# EAGLE design Opto_v2 (EAGLE 8.6.3)
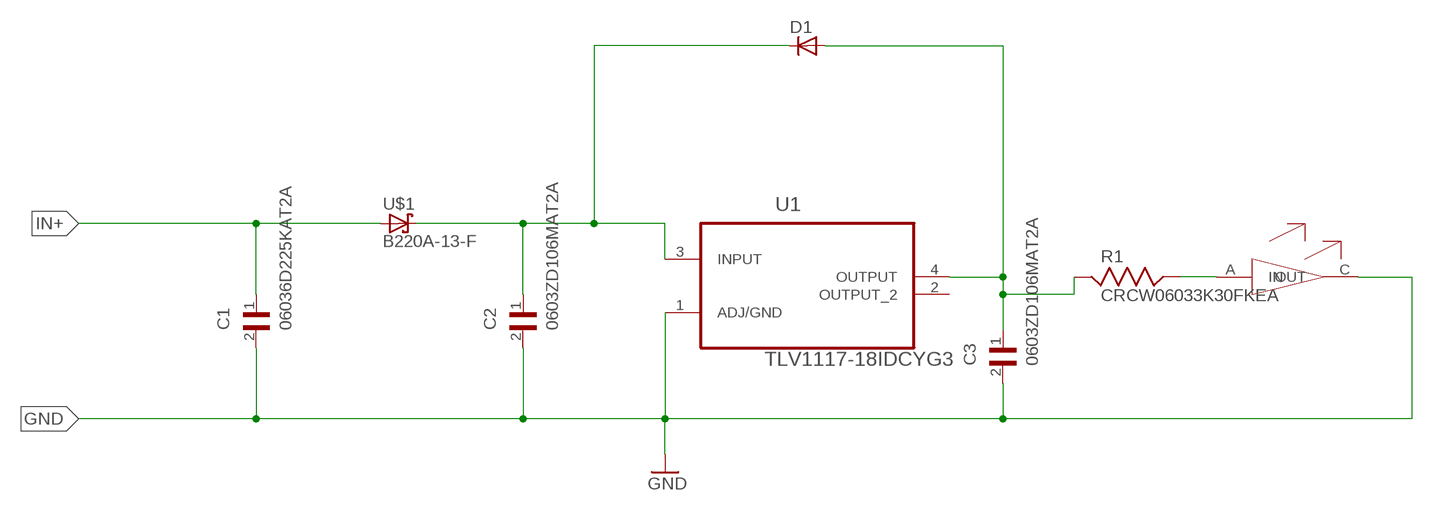
[diagram p0: schematic, sheet 1]

## Parts
C1  06036D225KAT2A  [CAPC1608X90]
C2  0603ZD106MAT2A  [CAPC1608X90]
C3  0603ZD106MAT2A  [CAPC1608X90]
D1  BYS10  [SOD106A]
R1  CRCW06033K30FKEA  [RESC1608X55]
U1  TLV1117-18IDCYG3  [SOT230P700X180-4N]
U$1  B220A-13-F  [SMA-DIODE]
U$3  LED  [LEDM1608X80]

## Nets
GND: C1.2 C2.2 C3.2 U1.1(ADJ/GND) U$3.C(OUT)
IN+: C1.1 U$1.1(A)
N$2: R1.2 U$3.A(IN)
N$3: C3.1 D1.A R1.1 U1.4(OUTPUT)
N$4: C2.1 D1.K U1.3(INPUT) U$1.2(C)
Unconnected: U1.2(OUTPUT_2)

## Library data of the parts
C1 = Capacitor_2.2uF_0603:06036D225KAT2A: Cap Ceramic 2.2uF 6.3V X5R 10% SMD 0603 85°C Paper T/R; DESCRIPTION: 0603 2.2 uF 6.3 V ±10 % Tolerance X5R Surface Mount Multilayer Ceramic Capacitor; DIGI-KEY_PART_NUMBER: 478-1252-1-ND; DIGI-KEY_PURCHASE_URL: https://www.digikey.co.uk/product-detail/en/avx-corporation/06036D225KAT2A/478-1252-1-ND/564284?utm_source=snapeda&utm_medium=aggregator&utm_campaign=symbol; MF: AVX; MP: 06036D225KAT2A; PACKAGE: 0603 AVX
C2 C3 = 0603ZD106MAT2A:0603ZD106MAT2A: Cap Ceramic 10uF 10V X5R 20% SMD 0603 85??? T/R; DESCRIPTION: 0603 10 uF 10 V ±20 % Tolerance X5R SMT Multilayer Ceramic Capacitor; DIGI-KEY_PART_NUMBER: 478-8050-1-ND; DIGI-KEY_PURCHASE_URL: https://www.digikey.com/product-detail/en/avx-corporation/0603ZD106MAT2A/478-8050-1-ND/3900666?utm_source=snapeda&utm_medium=aggregator&utm_campaign=symbol; MF: AVX; MP: 0603ZD106MAT2A; PACKAGE: 0603 AVX
D1 = telefunken:BYS10: DIODE; MPN: BYS10/45; OC_FARNELL: 9549188; OC_NEWARK: 96K7236
R1 = CRCW06033K30FKEA:CRCW06033K30FKEA: Res Thick Film 0603 3.3K Ohm 1% 0.1W(1/10W) ?100ppm/C SMD Automotive Paper T/R; DESCRIPTION: Res Thick Film 0603 3.3K Ohm 1% 0.1W_1/10W_ ?100ppm/C SMD Automotive Paper T/R; DIGI-KEY_PART_NUMBER: 541-3.30KHCT-ND; DIGI-KEY_PURCHASE_URL: https://www.digikey.com/product-detail/en/vishay-dale/CRCW06033K30FKEA/541-3.30KHCT-ND/1179866?utm_source=snapeda&utm_medium=aggregator&utm_campaign=symbol; MF: Vishay Dale; MP: CRCW06033K30FKEA; PACKAGE: 0603 Vishay
U1 = TLV1117-18IDCYG3:TLV1117-18IDCYG3: V REG, LDO, 3.3V, 0.8A; AVAILABILITY: Unavailable; DESCRIPTION: Single Output LDO, 800mA, Fixed and Adj., Internal Current limit, Thermal Overload Protection 4-SOT-223 -40 to 125; MF: Texas Instruments; MP: TLV1117-18IDCYG3; PACKAGE: SOT-223 Texas Instruments; PRICE: None
U$1 = Schottky_0603:B220A-13-F; DESCRIPTION: B220A Series 20 V 2 A Surface Mount Schottky Barrier Rectifier - SMA; DIGI-KEY_PART_NUMBER: B220A-FDICT-ND; DIGI-KEY_PURCHASE_URL: https://www.digikey.co.uk/product-detail/en/diodes-incorporated/B220A-13-F/B220A-FDICT-ND/751528?utm_source=snapeda&utm_medium=aggregator&utm_campaign=symbol; MF: Diodes Inc.; MP: B220A-13-F; PACKAGE: DO-214 Diodes Inc.
U$3 = LEDM1608X80:LED

## Board
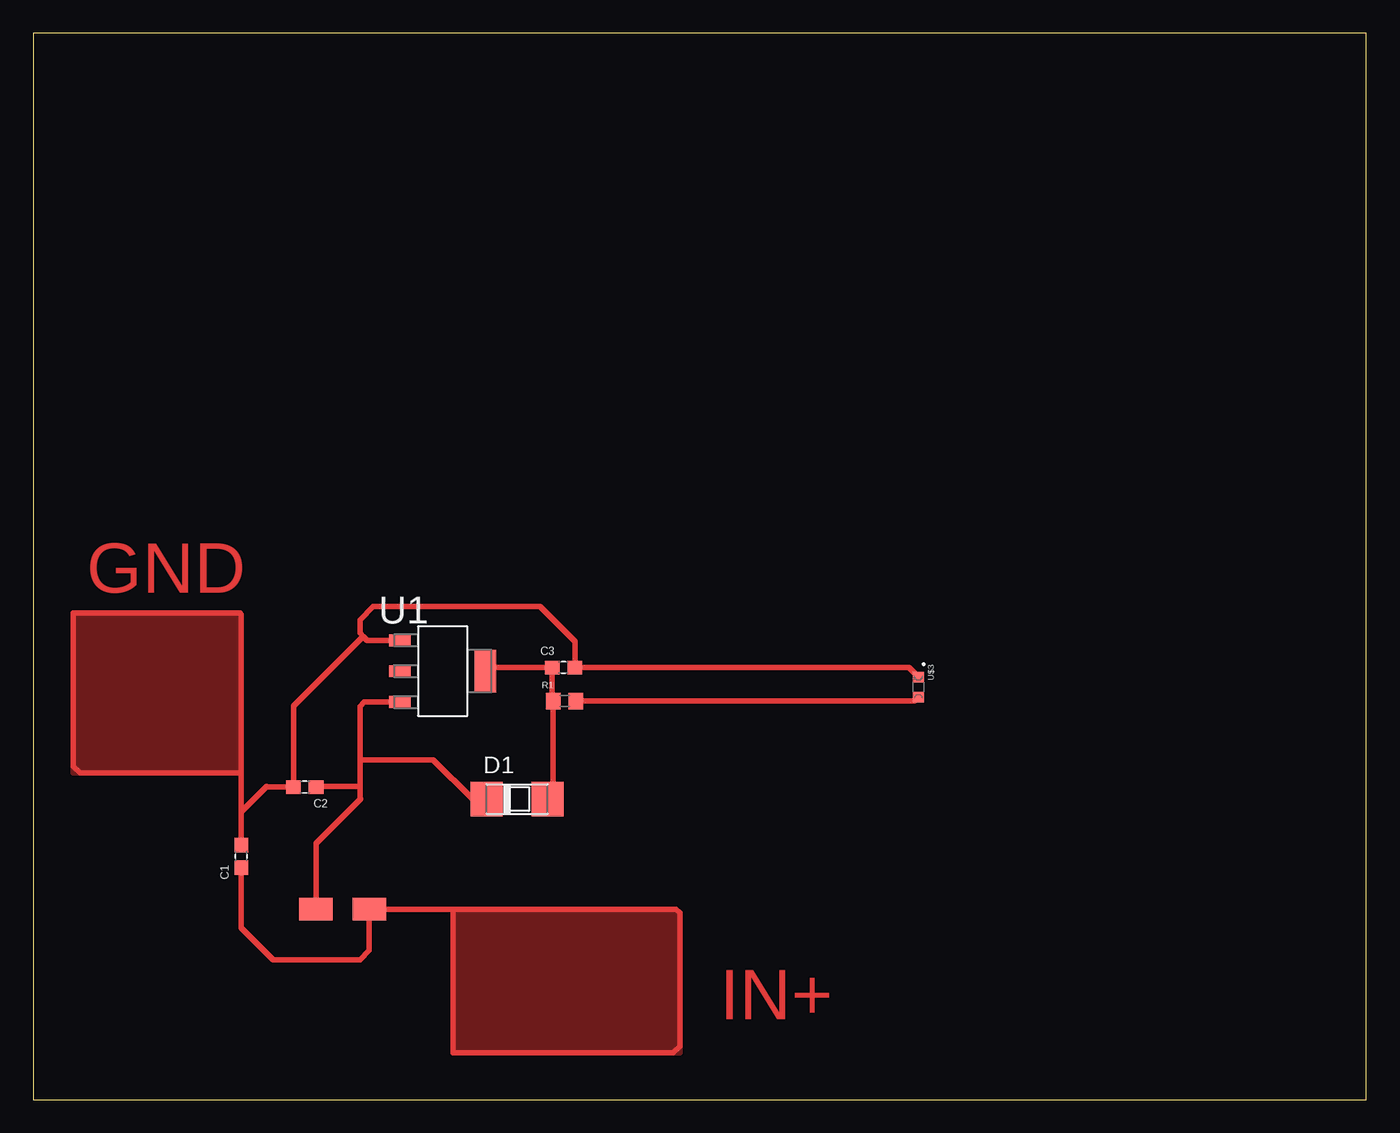
[diagram p1: board, top side]

Size 100 x 80 mm. Coordinates in mm from the lower left corner, seen from the top.
Outline: 0,0 100,0 100,80 0,80 0,0
Copper layers (1*16): Top 0.035mm / dielectric 1.5mm / Bottom 0.035mm
Design rules "default": minimum track width 6mil, minimum drill 0.35mm, track to track 6mil, track to pad 6mil, pad to pad 6mil, via to via 6mil, smd to smd 6mil, copper to edge 40mil, drill to drill 6mil, minimum pad ring 10mil, minimum via ring 8mil, stop-mask expansion 4mil, vias tented up to drill 0mil, thermal gap 10mil

### Footprints (pad centres in the part's own frame; a part is rotated, then mirrored left to right if it is on the bottom)
CAPC1608X90 = smd 1.1 x 1: 1 -0.85,0; 2 0.85,0
SOD106A = smd 2.4 x 2.6: A 2.3,0; K -2.3,0
RESC1608X55 = smd 1.1 x 1.25: 1 -0.85,0; 2 0.85,0
SOT230P700X180-4N = smd 1.626 x 0.889: 1 -3.2,2.311; 2 -3.2,0; 3 -3.2,-2.311 | smd 1.626 x 3.175: 4 3.2,0
SMA-DIODE = smd 2.5 x 1.7: 1 -1.992,0.015; 2 2.008,0.015
LEDM1608X80 = smd 0.8 x 0.8: A 0.75,0; C -0.75,0

### Placement (x,y rotation side)
C1  15.6,18.25 90 top
C2  20.37,23.45 180 top
C3  39.78,32.41 0 top
D1  36.29,22.55 0 top
R1  39.86,29.9 0 top
U1  30.71,32.14 0 top
U$1  23.21,14.29 180 top
U$3  66.4,30.95 270 top

### Tracks (layer width: path | path; a pad name or v marks a point on that pad's centre or on a via)
GND
  Top 0.406: U1.1 25.05,34.45 24.75,34.75 | 24.75,34.75 24.5,35 24.5,36 25.5,37 38,37 40.63,34.37 C3.2 65.69,32.41 U$3.C | 24.75,34.75 19.52,29.52 C2.2 17.55,23.45 17.5,23.5 15.6,21.6 | C1.2 15.6,21.6 | 15.6,21.6 15.6,36.4 15.5,36.5 3,36.5 3,25 3.5,24.5 15.5,24.5
  pour Top: 3,36.5 15.5,36.5 15.5,24.5 3,24.5
IN+
  Top 0.406: C1.1 15.6,12.9 18,10.5 24.5,10.5 25.2,11.2 U$1.1 48.23,14.28 48.5,14 48.5,4 48,3.5 31.5,3.5 31.5,14
  pour Top: 31.5,14 48.5,14 48.5,3.5 31.5,3.5
N$2
  Top 0.406: U$3.A 66.1,29.9 R1.2
N$3
  Top 0.406: U1.4 34.18,32.41 C3.1 38.93,29.98 R1.1 39.01,22.51 39,22.5 38.64,22.5 D1.A
N$4
  Top 0.406: U$1.2 21.2,19.2 24.55,22.55 24.5,22.6 24.5,23.5 | U1.3 24.83,29.83 24.5,29.5 24.5,25.5 | 24.5,25.5 24.5,23.5 | 24.5,25.5 30,25.5 32.95,22.55 D1.K | C2.1 21.27,23.5 24.5,23.5

### Text on the board
Top: GND | IN+